# Altium schematic sheet Auxilary.SchDoc
size A4; Organization: Altium Limited; Address1: L3, 12a Rodborough Rd; Address2: Frenchs Forest; Address3: NSW; Address4: Australia 2086; DocumentNumber: 1; SheetNumber: 1; SheetTotal: 8
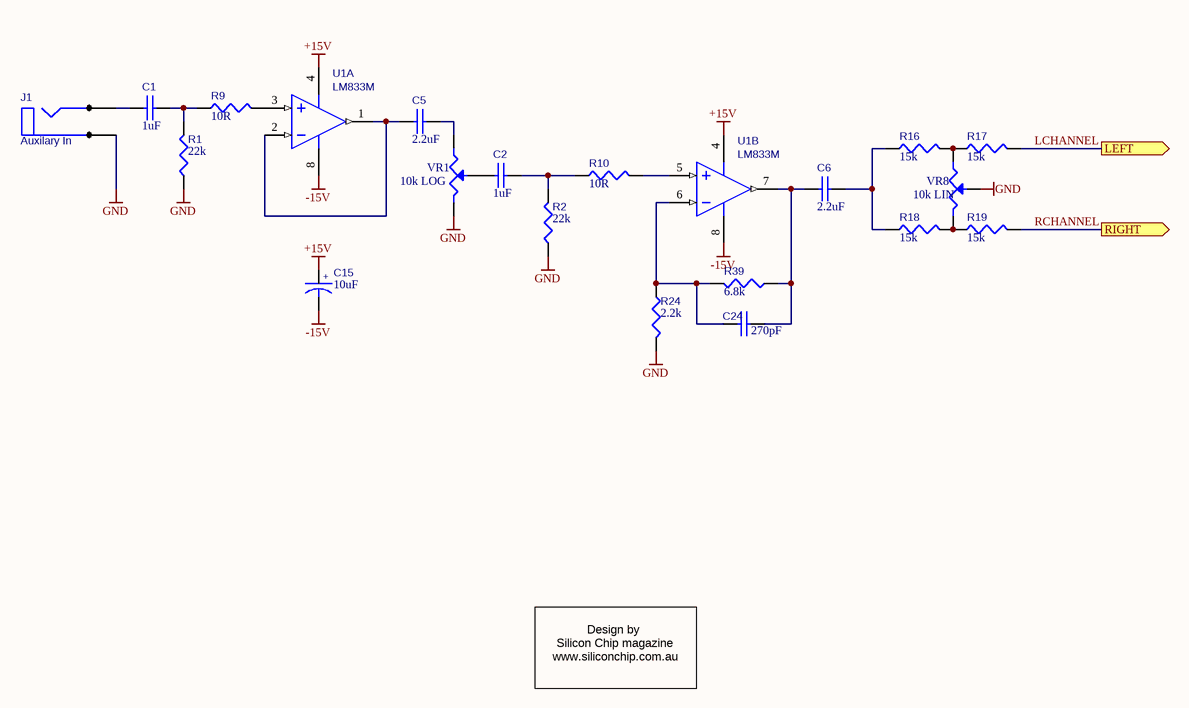
[diagram p0: Auxilary.SchDoc]

## Parts
C1  1uF  [RB.2/.4-NP]
C2  1uF  [RB.2/.4-NP]
C5  2.2uF  [RB.2/.4-NP]
C6  2.2uF  [RB.2/.4-NP]
C15  10uF  [RB.2/.4]
C24  270pF  [RAD0.2]
J1  Auxilary In  [JACK-6.25MM]
R1  22k  [AXIAL0.4]
R2  22k  [AXIAL0.4]
R9  10R  [AXIAL0.4]
R10  10R  [AXIAL0.4]
R16  15k  [AXIAL0.4]
R17  15k  [AXIAL0.4]
R18  15k  [AXIAL0.4]
R19  15k  [AXIAL0.4]
R24  2.2k  [AXIAL0.4]
R39  6.8k  [AXIAL0.4]
U1  LM833M  [DIP8]  (parts A,B of 2)
VR1  10k LOG  [POT - 24MM]
VR8  10k LIN  [POT - 24MM]

## Ports
LEFT (out), RIGHT (out)

## Nets
+15V: C15.1 U1.4(V-)
-15V: C15.2 U1.8(V+)
GND: J1.3(C) R1.1 R2.1 R24.2 VR1.3 VR8.2(W)
LCHANNEL: R17.2 ; port LEFT
RCHANNEL: R19.2 ; port RIGHT
NetC1_1: C1.1 J1.1(A)
NetC1_2: C1.2 R1.2 R9.1
NetC2_1: C2.1 VR1.2(W)
NetC2_2: C2.2 R2.2 R10.1
NetC5_1: C5.1 U1.1(OUT1) U1.2(IN1-)
NetC5_2: C5.2 VR1.1
NetC6_1: C6.1 C24.2 R39.1 U1.7(OUT2)
NetC6_2: C6.2 R16.1 R18.1
NetC24_1: C24.1 R24.1 R39.2 U1.6(IN2-)
NetR9_2: R9.2 U1.3(IN1+)
NetR10_2: R10.2 U1.5(IN2+)
NetR16_2: R16.2 R17.1 VR8.1
NetR18_2: R18.2 R19.1 VR8.3

## Notes on the sheet
- Design by
  Silicon Chip magazine
  www.siliconchip.com.au
- Title
- Size:
- Date:
- A4
- Number:
- Time:
- Revision:
- Sheet
- of
- File:
- (in symbol CAPACITOR POL) +

## Library data of the parts
C1 C2 C5 C6 C24 = CAP: Capacitor
  C24: Value: 270pF
C15 = CAPACITOR POL: Bi-Polar Capacitor; Value: 10uF
J1 = PHONEJACK MONO
R1 R2 R9 R10 R16-R19 R24 R39 = RES1: Resistor
  R1 R2: Value: 22k
  R9 R10: Value: 10R
  R16-R19: Value: 15k
  R24: Value: 2.2k
  R39: Value: 6.8k
U1 = LM833M: Fast Settling Dual Operational Amplifier
VR1 VR8 = POT1: Potentiometer